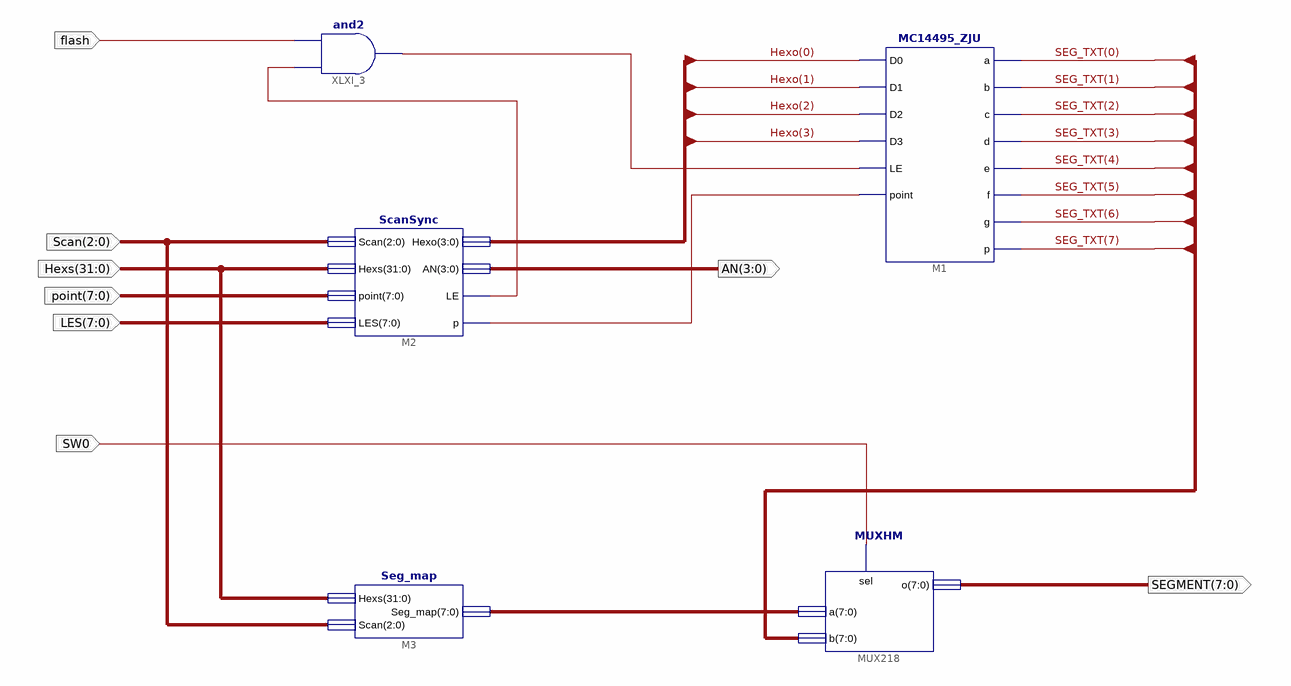
[diagram p0: schematic sheet 1]
// Xilinx ISE schematic Seg7_Dev.sch (kintex7) as structural Verilog: 5 symbols, 8 ports
module Seg7_Dev (
  input  flash,
  input  [2:0] Scan,
  input  [31:0] Hexs,
  input  [7:0] point,
  input  [7:0] LES,
  input  SW0,
  output [3:0] AN,
  output [7:0] SEGMENT
);

  wire XLXN_2, XLXN_16, XLXN_17;
  wire [3:0] Hexo;
  wire [7:0] SEG_TXT, XLXN_9;

  ScanSync M2 (.Scan(Scan), .Hexs(Hexs), .point(point), .LES(LES), .Hexo(Hexo), .AN(AN), .LE(XLXN_2), .p(XLXN_17));
  Seg_map M3 (.Hexs(Hexs), .Scan(Scan), .Seg_map(XLXN_9));
  and XLXI_3 (XLXN_16, XLXN_2, flash);
  MUXHM MUX218 (.a(XLXN_9), .b(SEG_TXT), .sel(SW0), .o(SEGMENT));
  MC14495_ZJU M1 (
    .D2(Hexo[2]), .D1(Hexo[1]), .D3(Hexo[3]), .D0(Hexo[0]), .point(XLXN_17), .LE(XLXN_16), .p(SEG_TXT[7]),
    .a(SEG_TXT[0]), .b(SEG_TXT[1]), .c(SEG_TXT[2]), .d(SEG_TXT[3]), .e(SEG_TXT[4]), .f(SEG_TXT[5]),
    .g(SEG_TXT[6]));
endmodule
